# Altium schematic sheet LPF.SchDoc
size A; SheetNumber: 4; SheetTotal: 6
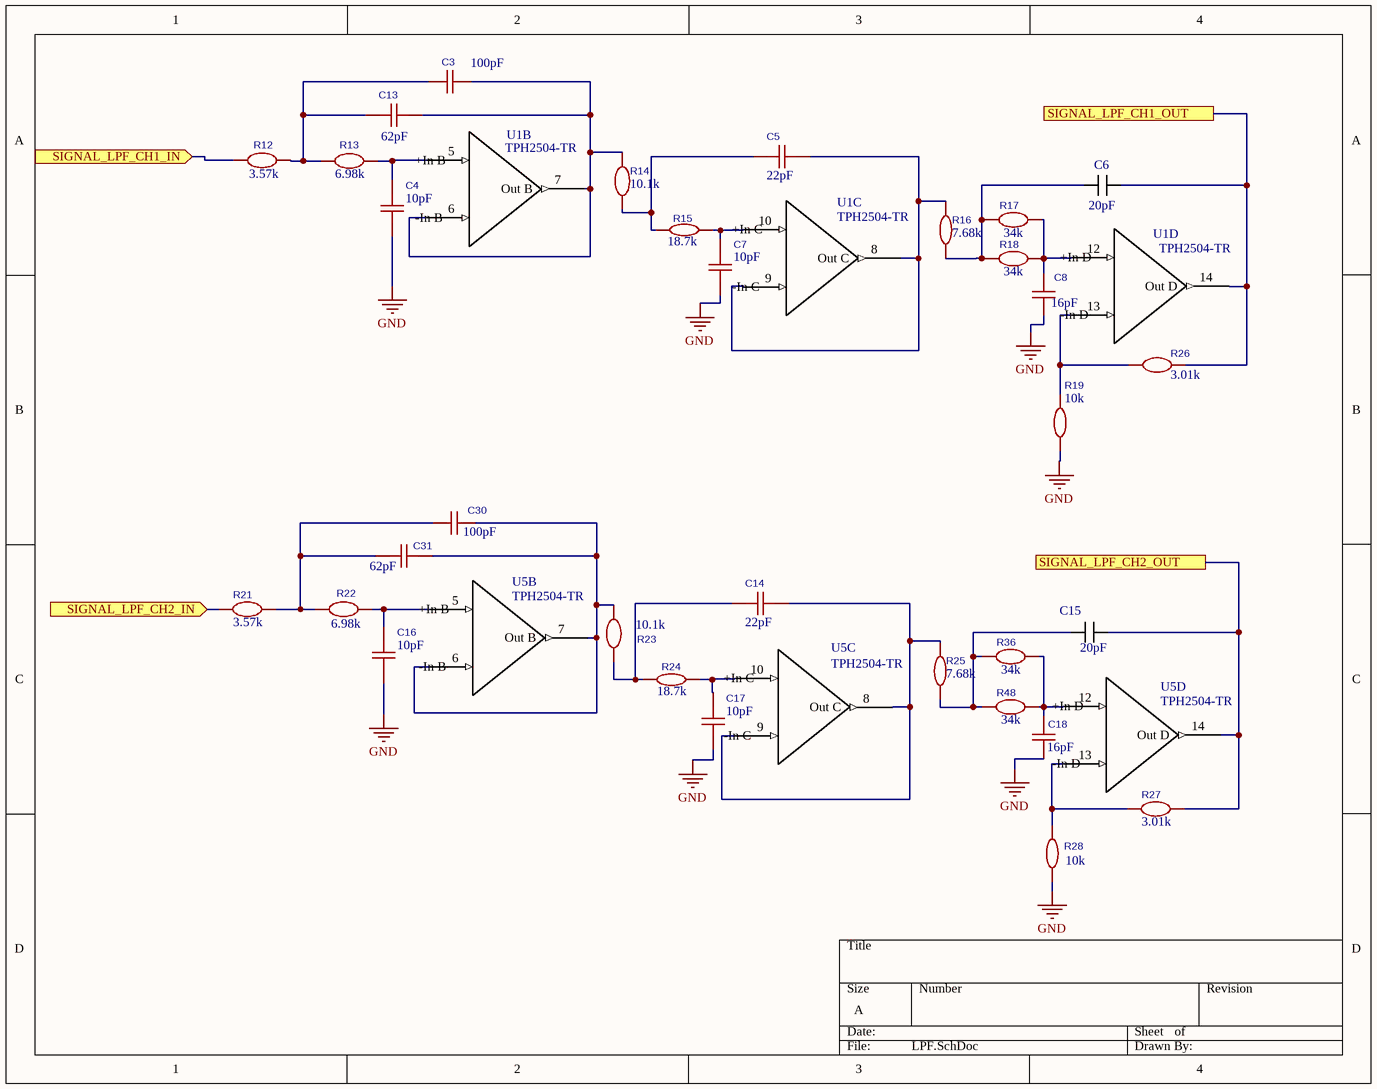
[diagram p0: LPF.SchDoc]

## Parts
C3  value 100pF  [C0603]  (hidden comment: CL10C101JB8NNNC)
C4  value 10pF  [C0805]  (hidden comment: VJ0805A100FXACW1BC)
C5  value 22pF  [C0805]  (hidden comment: TCC0805X5R226K100FT)
C6  value 20pF  [CAPCP2012X150N]  (hidden comment: Capacitor)
C7  value 10pF  [C0805]  (hidden comment: VJ0805A100FXACW1BC)
C8  value 16pF  [C0805]  (hidden comment: 0805CG6R0C500NT_C67560)
C13  value 62pF  [C0603]  (hidden comment: 0603CG620J500NT)
C14  value 22pF  [C0805]  (hidden comment: TCC0805X5R226K100FT)
C15  value 20pF  [CAPCP2012X150N]  (hidden comment: Capacitor)
C16  value 10pF  [C0805]  (hidden comment: VJ0805A100FXACW1BC)
C17  value 10pF  [C0805]  (hidden comment: VJ0805A100FXACW1BC)
C18  value 16pF  [C0805]  (hidden comment: 0805CG6R0C500NT_C67560)
C30  value 100pF  [C0603]  (hidden comment: CL10C101JB8NNNC)
C31  value 62pF  [C0603]  (hidden comment: 0603CG620J500NT)
R12  value 3.57k  [R0805]  (hidden comment: RT0805BRD0710K1L)
R13  value 6.98k  [R0805]  (hidden comment: RT0805BRD0710K1L)
R14  value 10.1k  [R0805]  (hidden comment: RT0805BRD0710K1L)
R15  value 18.7k  [R0805]  (hidden comment: 0805W8F0000T5E_C17477)
R16  value 7.68k  [R0805]  (hidden comment: 0805W8F0000T5E_C17477)
R17  value 34k  [R0805]  (hidden comment: FRC0805F3402TS)
R18  value 34k  [R0805]  (hidden comment: FRC0805F3402TS)
R19  value 10k  [R0805]  (hidden comment: 0805W8F0000T5E_C17477)
R21  value 3.57k  [R0805]  (hidden comment: RT0805BRD0710K1L)
R22  value 6.98k  [R0805]  (hidden comment: RT0805BRD0710K1L)
R23  value 10.1k  [R0805]  (hidden comment: RT0805BRD0710K1L)
R24  value 18.7k  [R0805]  (hidden comment: 0805W8F0000T5E_C17477)
R25  value 7.68k  [R0805]  (hidden comment: 0805W8F0000T5E_C17477)
R26  value 3.01k  [R0805]  (hidden comment: RT0805BRD0710K1L)
R27  value 3.01k  [R0805]  (hidden comment: RT0805BRD0710K1L)
R28  value 10k  [R0805]  (hidden comment: 0805W8F0000T5E_C17477)
R36  value 34k  [R0805]  (hidden comment: FRC0805F3402TS)
R48  value 34k  [R0805]  (hidden comment: FRC0805F3402TS)
U1  TPH2504-TR  [TSOP65P640X120-14N]  (parts B,C,D of 4)
U5  TPH2504-TR  [TSOP65P640X120-14N]  (parts B,C,D of 4)

## Ports
SIGNAL_LPF_CH1_IN (in, see PGA[3B]), SIGNAL_LPF_CH1_OUT (see H723ZG_Interface[1C], Trigger[2B]), SIGNAL_LPF_CH2_IN (in, see PGA[3C]), SIGNAL_LPF_CH2_OUT (see H723ZG_Interface[1C], Trigger[2A])

## Nets
GND: C4.1 C7.1 C8.2 C16.1 C17.1 C18.2 R19.1 R28.1
SIGNAL_LPF_CH1_IN: R12.1 ; port SIGNAL_LPF_CH1_IN
SIGNAL_LPF_CH1_OUT: C6.1 R26.2 ; port SIGNAL_LPF_CH1_OUT
SIGNAL_LPF_CH2_IN: R21.2 ; port SIGNAL_LPF_CH2_IN
SIGNAL_LPF_CH2_OUT: C15.1 R27.1 U5.14(Out_D) ; port SIGNAL_LPF_CH2_OUT
NetC3_1: C3.1 C13.1 R12.2 R13.1
NetC3_2: C3.2 C13.2 R14.2 U1.6(-In_B) U1.7(Out_B)
NetC4_2: C4.2 R13.2 U1.5(+In_B)
NetC5_1: C5.1 R14.1 R15.1
NetC5_2: C5.2 R16.2 U1.8(Out_C) U1.9(-In_C)
NetC6_2: C6.2 R16.1 R17.1 R18.1
NetC7_2: C7.2 R15.2 U1.10(+In_C)
NetC8_1: C8.1 R17.2 R18.2 U1.12(+In_D)
NetC14_1: C14.1 R23.2 R24.1
NetC14_2: C14.2 R25.2 U5.8(Out_C) U5.9(-In_C)
NetC15_2: C15.2 R25.1 R36.1 R48.1
NetC16_2: C16.2 R22.2 U5.5(+In_B)
NetC17_2: C17.2 R24.2 U5.10(+In_C)
NetC18_1: C18.1 R36.2 R48.2 U5.12(+In_D)
NetC30_1: C30.1 C31.1 R21.1 R22.1
NetC30_2: C30.2 C31.2 R23.1 U5.6(-In_B) U5.7(Out_B)
NetR19_2: R19.2 R26.1 U1.13(-In_D)
NetR27_2: R27.2 R28.2 U5.13(-In_D)

Not connected (* = marked no-connect by the designer): U1 14(Out_D)

## Library data of the parts
C3 C30 = CMP-015-000009-1: Capacitance:100pF Tolerance:±5% Tolerance:±5% Voltage Rating:50V Temperature Coefficient:C0G; Manufacturer: SAMSUNG(三星); Temperature Coefficient: C0G; Voltage Rating: 50V; ModelTransform: 62.992,31.496,0,0,0,0,0,0,0; Tolerance: 5%; ModelName: C0603_L1.6-W0.8-H0.8; ModelId: 624118aa3cc7497086c383c2d72e0852ÂŽ0819f05c4eef4c71ace90d822a990e87; ConvertToPcb: yes; Datasheet: https://item.szlcsc.com/datasheet/CL10C101JB8NNNC/15530.html; ManufacturerPart: CL10C101JB8NNNC; FootprintName: C0603; Device: CL10C101JB8NNNC; Design Item ID: CL10C101JB8NNNC; Supplier Footprint: 0603; Source: P1.SCHLIB; Symbol: CL10C101JB8NNNC; JLCPCB Part Class: Basic Part; SupplierPart: C14858; LCSC Part Name: 100pF ±5% 50V; AddInBom: yes
C4 C7 C16 C17 = CMP-015-000004-1: Capacitance:10pF Tolerance:±1% Tolerance:±1% Voltage Rating:50V Temperature Coefficient:C0G; Manufacturer: VISHAY(威世); AddInBom: yes; ModelId: 8c88e81f49c6409b980720ec8953afb6聨0819f05c4eef4c71ace90d822a990e87; ModelName: C0805_L2.0-W1.3-H1.3; ModelTransform: 78.74,51.181,0,0,0,0,0,0.0005,0; Temperature Coefficient: C0G; Tolerance: 1%; Voltage Rating: 50V; ConvertToPcb: yes; Datasheet: https://item.szlcsc.com/datasheet/VJ0805A100FXACW1BC/2269676.html; Design Item ID: VJ0805A100FXACW1BC; Device: VJ0805A100FXACW1BC; FootprintName: C0805; JLCPCB Part Class: Extended Part; LCSC Part Name: 10pF ±1% 50V; Source: P1.SCHLIB; Supplier Footprint: 0805; Symbol: VJ0805A100FXACW1BC; Manufacturer Part Number: VJ0805A100FXACW1BC; Supplier Part Number: C2177610
C5 C14 = CMP-015-000002-1: Capacitance:22pF Tolerance:±1% Tolerance:±1% Voltage Rating:50V Temperature Coefficient:C0G; Manufacturer: FH(风华); AddInBom: yes; Device: 0805CG220F500NT; ModelId: 8c88e81f49c6409b980720ec8953afb6聨0819f05c4eef4c71ace90d822a990e87; ModelName: C0805_L2.0-W1.3-H1.3; ModelTransform: 78.74,51.181,0,0,0,0,0,0.0005,0; Temperature Coefficient: C0G; Tolerance: 1%; Voltage Rating: 50V; ConvertToPcb: yes; Datasheet: https://item.szlcsc.com/datasheet/0805CG220F500NT/208470.html; Design Item ID: 0805CG220F500NT; FootprintName: C0805; JLCPCB Part Class: Extended Part; LCSC Part Name: 22pF ±1% 50V; Source: P1.SCHLIB; Supplier Footprint: 0805; Symbol: 0805CG220F500NT; Manufacturer Part Number: 0805CG220F500NT; Supplier Part Number: C190088
C6 C15 = CMP-00003-4: Mlcc 20PF ±5% C0G(NP0) 50V 0805; Manufacturer: CCTC; Manufacturer Part Number: TCC0805COG200J500BT; Supplier Part Number: C5375851; Supplier: JLCPCB
C8 C18 = CMP-015-000001-1: Capacitance:16pF Tolerance:±5% Tolerance:±5% Voltage Rating:50V Temperature Coefficient:C0G; Manufacturer: FH(风华); AddInBom: yes; Device: 0805CG160J500NT; ModelId: 8c88e81f49c6409b980720ec8953afb6聨0819f05c4eef4c71ace90d822a990e87; ModelName: C0805_L2.0-W1.3-H1.3; ModelTransform: 78.74,51.181,0,0,0,0,0,0.0005,0; Temperature Coefficient: C0G; Tolerance: 5%; Voltage Rating: 50V; ConvertToPcb: yes; Datasheet: https://item.szlcsc.com/datasheet/0805CG160J500NT/2148.html; Design Item ID: 0805CG160J500NT; FootprintName: C0805; JLCPCB Part Class: Extended Part; LCSC Part Name: 16pF ±5% 50V; Source: P1.SCHLIB; Supplier Footprint: 0805; Symbol: 0805CG160J500NT; Manufacturer Part Number: 0805CG160J500NT; Supplier Part Number: C1796
C13 C31 = CMP-015-000008-1: Capacitance:62pF Tolerance:±5% Tolerance:±5% Voltage Rating:50V Temperature Coefficient:C0G; Manufacturer: FH(风华); Temperature Coefficient: C0G; ModelName: C0603_L1.6-W0.8-H0.8; Voltage Rating: 50V; AddInBom: yes; Tolerance: 5%; ModelId: 624118aa3cc7497086c383c2d72e0852ÂŽ0819f05c4eef4c71ace90d822a990e87; ModelTransform: 62.992,31.496,0,0,0,0,0,0,0; LCSC Part Name: 62pF ±5% 50V; Supplier Footprint: 0603; ManufacturerPart: 0603CG620J500NT; Device: 0603CG620J500NT; SupplierPart: C60732; Datasheet: https://item.szlcsc.com/datasheet/0603CG620J500NT/61784.html; Symbol: 0603CG620J500NT; Source: P1.SCHLIB; JLCPCB Part Class: Extended Part; Design Item ID: 0603CG620J500NT; FootprintName: C0603; ConvertToPcb: yes
R12 R21 = CMP-016-000012-1: Type:Thick Film Resistor Resistance:3.57kΩ Tolerance:±1% Tolerance:±1% Power(Watts):125mW Voltage-Supply(Max):150V Temperature Coefficient:±100ppm/℃ Temperature Coefficient:±100ppm/℃ Operating Temperature:-55℃~+155℃ Operating Temperature:-55℃~+155℃; Manufacturer: FOJAN(富捷); AddInBom: yes; Device: FRC0805F3571TS; ModelId: b83c7c5430874b8eb2319a65d9433429聨0819f05c4eef4c71ace90d822a990e87; ModelName: R0805_L2.0-W1.3-H0.6; ModelTransform: 78.74,51.181,0,0,0,0,0,-0.0005,0; Power(Watts): 125mW; Tolerance: 1%; Voltage-Supply(Max): 150V; ConvertToPcb: yes; Datasheet: https://item.szlcsc.com/datasheet/FRC0805F3571TS/3279527.html; Design Item ID: FRC0805F3571TS; FootprintName: R0805; JLCPCB Part Class: Extended Part; LCSC Part Name: 3.57kΩ ±1% 125mW 厚膜电阻; Operating Temperature: -55℃~+155℃; Source: P1.SCHLIB; Supplier Footprint: 0805; Symbol: FRC0805F3571TS; Temperature Coefficient: ±100ppm/℃; Type: Thick Film Resistor; Manufacturer Part Number: FRC0805F3571TS; Supplier Part Number: C2933425
R13 R22 = CMP-016-000014-1: Type:Thick Film Resistor Resistance:6.98kΩ Tolerance:±1% Tolerance:±1% Power(Watts):125mW Voltage-Supply(Max):150V Temperature Coefficient:±100ppm/℃ Temperature Coefficient:±100ppm/℃ Operating Temperature:-55℃~+155℃ Operating Temperature:-55℃~+155℃; Manufacturer: FOJAN(富捷); AddInBom: yes; Device: FRC0805F6981TS; ModelId: b83c7c5430874b8eb2319a65d9433429聨0819f05c4eef4c71ace90d822a990e87; ModelName: R0805_L2.0-W1.3-H0.6; ModelTransform: 78.74,51.181,0,0,0,0,0,-0.0005,0; Power(Watts): 125mW; Tolerance: 1%; Voltage-Supply(Max): 150V; ConvertToPcb: yes; Datasheet: https://item.szlcsc.com/datasheet/FRC0805F6981TS/3279591.html; Design Item ID: FRC0805F6981TS; FootprintName: R0805; JLCPCB Part Class: Extended Part; LCSC Part Name: 6.98kΩ ±1% 125mW 厚膜电阻; Operating Temperature: -55℃~+155℃; Source: P1.SCHLIB; Supplier Footprint: 0805; Symbol: FRC0805F6981TS; Temperature Coefficient: ±100ppm/℃; Type: Thick Film Resistor; Manufacturer Part Number: FRC0805F6981TS; Supplier Part Number: C2933489
R14 R23 = CMP-016-000017-1: Type:Thin Film Resistor Resistance:10.1kΩ Tolerance:±0.1% Tolerance:±0.1% Power(Watts):125mW Temperature Coefficient:±25ppm/℃ Temperature Coefficient:±25ppm/℃ Operating Temperature:-55℃~+155℃ Operating Temperature:-55℃~+155℃; Manufacturer: YAGEO(国巨); AddInBom: yes; ModelId: b83c7c5430874b8eb2319a65d9433429聨0819f05c4eef4c71ace90d822a990e87; ModelName: R0805_L2.0-W1.3-H0.6; ModelTransform: 78.74,51.181,0,0,0,0,0,-0.0005,0; Power(Watts): 125mW; Tolerance: 0.1%; ConvertToPcb: yes; Datasheet: https://item.szlcsc.com/datasheet/RT0805BRD0710K1L/925214.html; Design Item ID: RT0805BRD0710K1L; Device: RT0805BRD0710K1L; FootprintName: R0805; JLCPCB Part Class: Extended Part; LCSC Part Name: 薄膜电阻 10.1kΩ ±0.1% 125mW; Operating Temperature: -55℃~+155℃; Source: P1.SCHLIB; Supplier Footprint: 0805; Symbol: RT0805BRD0710K1L; Temperature Coefficient: ±25ppm/℃; Type: Thin Film Resistor; Manufacturer Part Number: RT0805BRD0710K1L; Supplier Part Number: C865133
R15 R24 = CMP-016-000004-1: Type:Thick Film Resistor Resistance:18.7kΩ Tolerance:±1% Tolerance:±1% Power(Watts):125mW Voltage-Supply(Max):150V Temperature Coefficient:±100ppm/℃ Temperature Coefficient:±100ppm/℃ Operating Temperature:-55℃~+155℃ Operating Temperature:-55℃~+155℃; Manufacturer: UNI-ROYAL(厚声); AddInBom: yes; Device: 0805W8F1872T5E; ModelId: b83c7c5430874b8eb2319a65d9433429聨0819f05c4eef4c71ace90d822a990e87; ModelName: R0805_L2.0-W1.3-H0.6; ModelTransform: 78.74,51.181,0,0,0,0,0,-0.0005,0; Power(Watts): 125mW; Tolerance: 1%; Voltage-Supply(Max): 150V; ConvertToPcb: yes; Datasheet: https://item.szlcsc.com/datasheet/0805W8F1872T5E/18187.html; Design Item ID: 0805W8F1872T5E; FootprintName: R0805; JLCPCB Part Class: Extended Part; LCSC Part Name: 18.7kΩ ±1% 125mW 厚膜电阻; Operating Temperature: -55℃~+155℃; Source: P1.SCHLIB; Supplier Footprint: 0805; Symbol: 0805W8F1872T5E; Temperature Coefficient: ±100ppm/℃; Type: Thick Film Resistor; Manufacturer Part Number: 0805W8F1872T5E; Supplier Part Number: C17499
R16 R25 = CMP-016-000016-1: Type:Thick Film Resistor Resistance:7.68kΩ Tolerance:±1% Tolerance:±1% Power(Watts):125mW Voltage-Supply(Max):150V Temperature Coefficient:±100ppm/℃ Temperature Coefficient:±100ppm/℃ Operating Temperature:-55℃~+155℃ Operating Temperature:-55℃~+155℃; Manufacturer: YAGEO(国巨); AddInBom: yes; Device: RC0805FR-077K68L; ModelId: b83c7c5430874b8eb2319a65d9433429聨0819f05c4eef4c71ace90d822a990e87; ModelName: R0805_L2.0-W1.3-H0.6; ModelTransform: 78.74,51.181,0,0,0,0,0,-0.0005,0; Power(Watts): 125mW; Tolerance: 1%; Voltage-Supply(Max): 150V; ConvertToPcb: yes; Datasheet: https://item.szlcsc.com/datasheet/RC0805FR-077K68L/262366.html; Design Item ID: RC0805FR-077K68L; FootprintName: R0805; JLCPCB Part Class: Extended Part; LCSC Part Name: 厚膜电阻 7.68kΩ ±1% 125mW; Operating Temperature: -55℃~+155℃; Source: P1.SCHLIB; Supplier Footprint: 0805; Symbol: RC0805FR-077K68L; Temperature Coefficient: ±100ppm/℃; Type: Thick Film Resistor; Manufacturer Part Number: RC0805FR-077K68L; Supplier Part Number: C273951
R17 R18 R36 R48 = CMP-016-000011-1: Type:Thick Film Resistor Resistance:34kΩ Tolerance:±1% Tolerance:±1% Power(Watts):125mW Voltage-Supply(Max):150V Temperature Coefficient:±100ppm/℃ Temperature Coefficient:±100ppm/℃ Operating Temperature:-55℃~+155℃ Operating Temperature:-55℃~+155℃; Manufacturer: FOJAN(富捷); ModelName: R0805_L2.0-W1.3-H0.6; Power(Watts): 125mW; ConvertToPcb: yes; Tolerance: 1%; ModelId: b83c7c5430874b8eb2319a65d9433429聨0819f05c4eef4c71ace90d822a990e87; ModelTransform: 78.74,51.181,0,0,0,0,0,-0.0005,0; Voltage-Supply(Max): 150V; Supplier Footprint: 0805; Type: Thick Film Resistor; Operating Temperature: -55℃~+155℃; Datasheet: https://item.szlcsc.com/datasheet/FRC0805F3402TS/3279522.html; AddInBom: yes; Temperature Coefficient: ±100ppm/℃; Source: P1.SCHLIB; Device: FRC0805F3402TS; LCSC Part Name: 34kΩ ±1% 125mW 厚膜电阻; FootprintName: R0805; Symbol: FRC0805F3402TS; JLCPCB Part Class: Extended Part; Design Item ID: FRC0805F3402TS; Manufacturer Part Number: FRC0805F3402TS; Supplier Part Number: C2933420
R19 R28 = CMP-016-000002-1: Type:Thick Film Resistor Resistance:10kΩ Tolerance:±1% Tolerance:±1% Power(Watts):125mW Voltage-Supply(Max):150V Temperature Coefficient:±100ppm/℃ Temperature Coefficient:±100ppm/℃ Operating Temperature:-55℃~+155℃ Operating Temperature:-55℃~+155℃; Manufacturer: UNI-ROYAL(厚声); AddInBom: yes; Device: 0805W8F1002T5E; ModelId: b83c7c5430874b8eb2319a65d9433429聨0819f05c4eef4c71ace90d822a990e87; ModelName: R0805_L2.0-W1.3-H0.6; ModelTransform: 78.74,51.181,0,0,0,0,0,-0.0005,0; Power(Watts): 125mW; Tolerance: 1%; Voltage-Supply(Max): 150V; ConvertToPcb: yes; Datasheet: https://item.szlcsc.com/datasheet/0805W8F1002T5E/18102.html; Design Item ID: 0805W8F1002T5E; FootprintName: R0805; JLCPCB Part Class: Basic Part; LCSC Part Name: 10kΩ ±1% 125mW 厚膜电阻; Operating Temperature: -55℃~+155℃; Source: P1.SCHLIB; Supplier Footprint: 0805; Symbol: 0805W8F1002T5E; Temperature Coefficient: ±100ppm/℃; Type: Thick Film Resistor; Manufacturer Part Number: 0805W8F1002T5E; Supplier Part Number: C17414
R26 R27 = CMP-016-000010-1: Type:Thick Film Resistor Resistance:3.01kΩ Tolerance:±1% Tolerance:±1% Power(Watts):125mW Voltage-Supply(Max):150V Temperature Coefficient:±100ppm/℃ Temperature Coefficient:±100ppm/℃ Operating Temperature:-55℃~+155℃ Operating Temperature:-55℃~+155℃; Manufacturer: FOJAN(富捷); AddInBom: yes; Device: FRC0805F3011TS; ModelId: b83c7c5430874b8eb2319a65d9433429聨0819f05c4eef4c71ace90d822a990e87; ModelName: R0805_L2.0-W1.3-H0.6; ModelTransform: 78.74,51.181,0,0,0,0,0,-0.0005,0; Power(Watts): 125mW; Tolerance: 1%; Voltage-Supply(Max): 150V; ConvertToPcb: yes; Datasheet: https://item.szlcsc.com/datasheet/FRC0805F3011TS/3476925.html; Design Item ID: FRC0805F3011TS; FootprintName: R0805; JLCPCB Part Class: Extended Part; LCSC Part Name: 3.01kΩ ±1% 125mW 厚膜电阻; Operating Temperature: -55℃~+155℃; Source: P1.SCHLIB; Supplier Footprint: 0805; Symbol: FRC0805F3011TS; Temperature Coefficient: ±100ppm/℃; Type: Thick Film Resistor; Manufacturer Part Number: FRC0805F3011TS; Supplier Part Number: C2999485
U1 U5 = CMP-00002-9: Operational Amplifier, 4 Func, 5000uV Offset-Max, CMOS, PDSO14; Max Supply Voltage: 7V; Number of Circuits: 4; Nominal Supply Voltage (DC): 3V; Input Offset Voltage (Vos): 5mV; Max Supply Current: 48mA; GAIN: 120Meg; Unity Gain Bandwidth Product: 120MHz; Common Mode Rejection Ratio: 45dB; Slew Rate: 160V/µs; Number of Terminals: 14; Terminal Pitch: 650µm; Max Operating Temperature: 125°C; Height - Seated (Max): 1.2mm; Length: 4.96mm; Min Operating Temperature: -40°C; RoHS: Compliant; Width: 4.4mm; Case/Package: TSSOP; Temperature Grade: Automotive